# Altium project SCH.PrjPcb
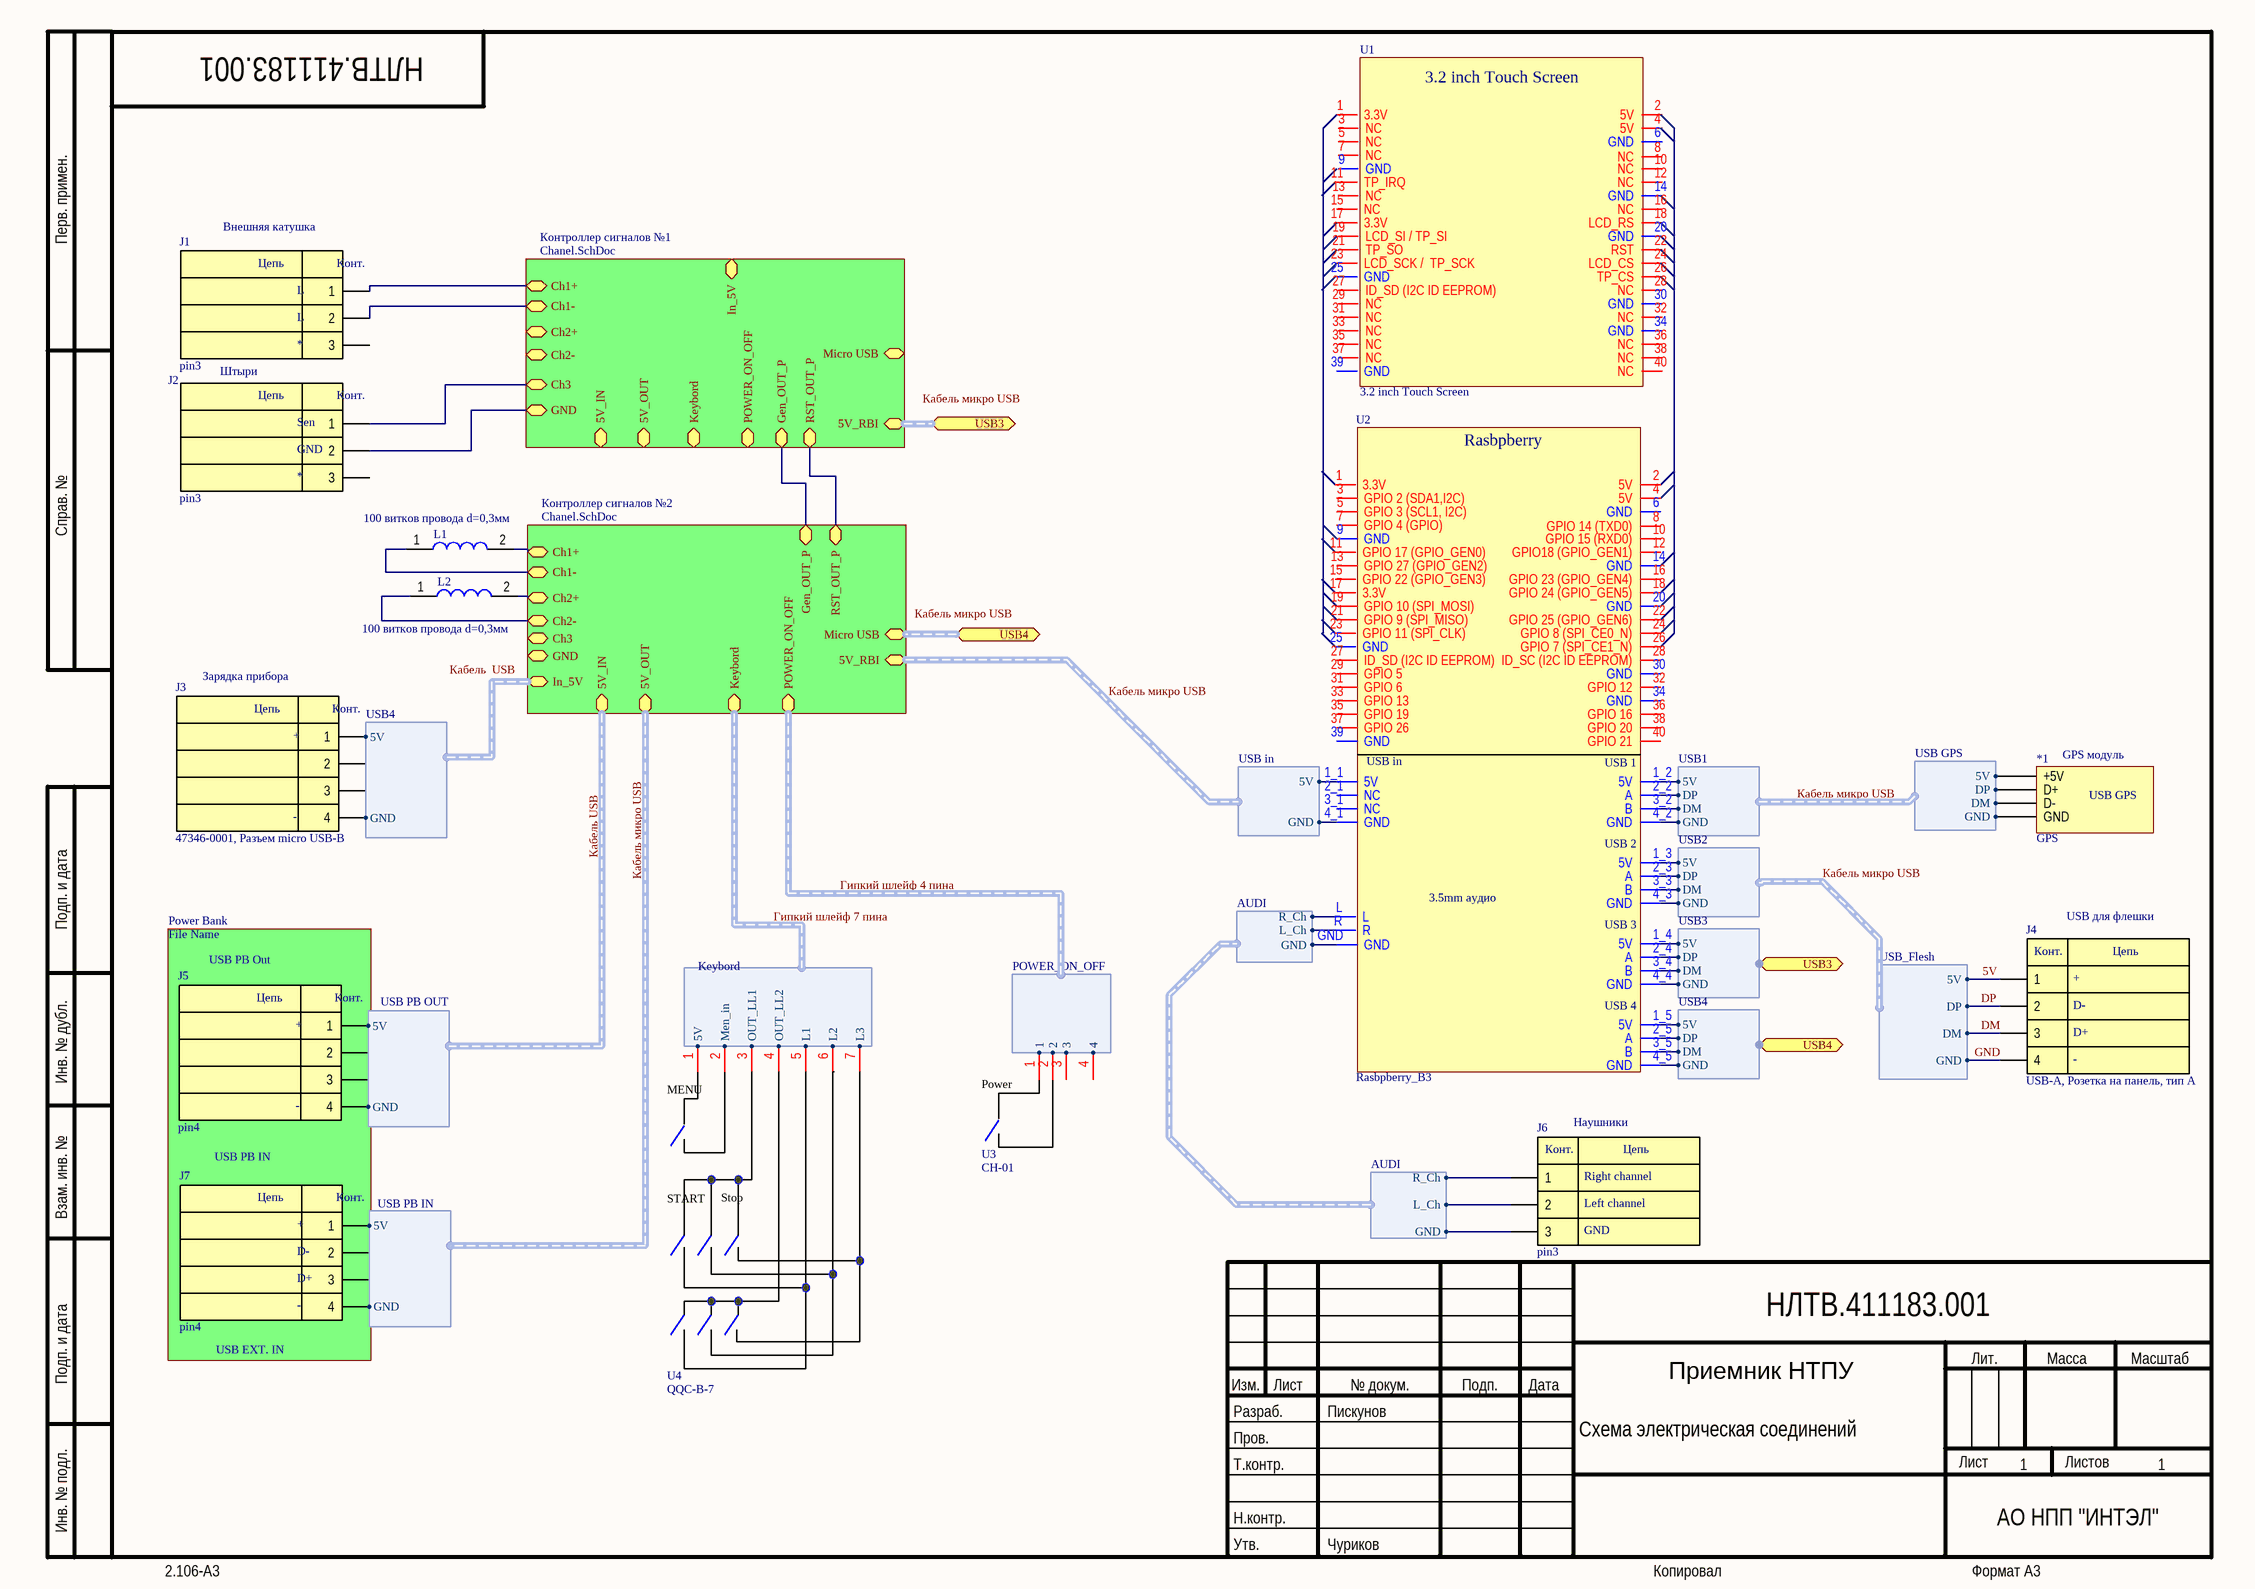
[diagram p0: Main.SchDoc]
2 sheets, 106 parts. Net scope: hierarchical (ports join the sheet entries above them; power ports are global).
Sheets:
  Main.SchDoc
    Контроллер сигналов №1 = Chanel.SchDoc
    Контроллер сигналов №2 = Chanel.SchDoc

## Sheet Main.SchDoc: Приемник НТПУ
size 420 x 297 mm; ApprovedBy: Чуриков; Author: Пискунов; CompanyName: АО НПП "ИНТЭЛ"; DocumentNumber: НЛТВ.411183.001; SheetNumber: 1; SheetTotal: 1; GOST_tip_4erteja: Схема электрическая соединений; CurrentDate: 1

### Parts
*1  GPS
J1  pin3  [300-031-12]
J2  pin3  [300-031-12]
J3  47346-0001, Разъем micro USB-B  [MF-4MA]
J4  USB-A, Розетка на панель, тип А  [MF-4MA]
J5  pin4  [MF-4MA]
J6  pin3  [300-031-12]
J7  pin4  [MF-4MA]
L1  100 витков провода d=0,3мм
L2  100 витков провода d=0,3мм
U1  3.2 inch Touch Screen
U2  Rasbpberry_B3
U3  CH-01  [PSOP8]
U4  QQC-B-7  [PSOP8]

### Sub-sheets
Power Bank = File Name (file not in this document): no entries
Контроллер сигналов №1 = Chanel.SchDoc: Micro USB, Ch1+, Ch1-, Ch2+, Ch2-, Ch3, 5V_IN, 5V_OUT, 5V_RBI (harness 5V_RBI), Gen_OUT_P, RST_OUT_P, Keybord (harness Keybord), POWER_ON_OFF (harness POWER_ON_OFF), In_5V, GND
Контроллер сигналов №2 = Chanel.SchDoc: Micro USB, Ch1+, Ch1-, Ch2+, Ch2-, Ch3, 5V_IN (harness USB PB OUT), 5V_OUT (harness USB PB IN), 5V_RBI (harness USB in), Gen_OUT_P, RST_OUT_P, Keybord (harness Keybord), POWER_ON_OFF (harness POWER_ON_OFF), In_5V (harness USB4), GND

### Ports
USB3, USB3 (harness USB3), USB4, USB4 (harness USB4)

### Harnesses
USB_Flesh: 5V, DP, DM, GND
AUDI: R_Ch, L_Ch, GND
Keybord: 5V, Men_in, OUT_LL1, OUT_LL2, L1, L2, L3
POWER_ON_OFF: 1, 2, 3, 4
USB GPS: 5V, DP, DM, GND
USB1: 5V, DP, DM, GND
USB2: 5V, DP, DM, GND
USB3: 5V, DP, DM, GND
USB4: 5V, DP, DM, GND
USB in: 5V, GND
USB PB OUT: 5V, GND
USB PB IN: 5V, GND
USB4: 5V, GND

### Nets
GND: J2.2 ; sheet Контроллер сигналов №1/GND, sheet Контроллер сигналов №2/GND
5V: *1.?1(+5V) J4.1 J7.1 U2.1_2(5V) U2.1_3(5V) ; sheet Контроллер сигналов №2/5V_OUT.5V
DM: *1.?3(D-) J4.3 U2.3_2(B) U2.3_3(B) ; sheet Контроллер сигналов №2/5V_OUT.DM
DP: *1.?2(D+) J4.2 U2.2_2(A) U2.2_3(A) ; sheet Контроллер сигналов №2/5V_OUT.DP
Gen_OUT_P: sheet Контроллер сигналов №1/Gen_OUT_P, sheet Контроллер сигналов №2/Gen_OUT_P
GND: *1.?4(GND) J4.4 J7.4 U2.4_2(GND) U2.4_3(GND) ; sheet Контроллер сигналов №2/5V_OUT.GND  [a separate net that carries the same name]
RST_OUT_P: sheet Контроллер сигналов №1/RST_OUT_P, sheet Контроллер сигналов №2/RST_OUT_P
Sen: J2.1 ; sheet Контроллер сигналов №1/Ch3
Vout_R1: L1.1 ; sheet Контроллер сигналов №2/Ch1-
Vout_R1: J1.2 ; sheet Контроллер сигналов №1/Ch1-  [a separate net that carries the same name]
Vout_R2: L2.1 ; sheet Контроллер сигналов №2/Ch2-
Гипкий шлейф 4 пина.1: U3.1 ; sheet Контроллер сигналов №2/POWER_ON_OFF.1
Гипкий шлейф 4 пина.2: U3.2 ; sheet Контроллер сигналов №2/POWER_ON_OFF.2
Гипкий шлейф 4 пина.3: U3.3 ; sheet Контроллер сигналов №2/POWER_ON_OFF.3
Гипкий шлейф 4 пина.4: U3.4 ; sheet Контроллер сигналов №2/POWER_ON_OFF.4
Кабель USB.5V: J5.1 ; sheet Контроллер сигналов №2/5V_IN.5V
Кабель USB.GND: J5.4 ; sheet Контроллер сигналов №2/5V_IN.GND
NetJ1_1: J1.1 ; sheet Контроллер сигналов №1/Ch1+
NetJ3_1: J3.1 ; sheet Контроллер сигналов №2/In_5V.5V
NetJ3_4: J3.4 ; sheet Контроллер сигналов №2/In_5V.GND
NetJ6_1: J6.1 U2.L ; harness AUDI.R_Ch
NetJ6_2: J6.2 U2.R ; harness AUDI.L_Ch
NetJ6_3: J6.3 U2.GND ; harness AUDI.GND
NetJ13_Контроллер_сигналов_№2_1: L1.2 ; sheet Контроллер сигналов №2/Ch1+
NetJ14_Контроллер_сигналов_№2_1: L2.2 ; sheet Контроллер сигналов №2/Ch2+
NetU2_1_1: U2.1_1(5V) ; sheet Контроллер сигналов №2/5V_RBI.5V
NetU2_1_4: U2.1_4(5V) ; port USB3.5V
NetU2_1_5: U2.1_5(5V) ; port USB4.5V
NetU2_2_4: U2.2_4(A) ; port USB3.DP
NetU2_2_5: U2.2_5(A) ; port USB4.DP
NetU2_3_4: U2.3_4(B) ; port USB3.DM
NetU2_3_5: U2.3_5(B) ; port USB4.DM
NetU2_4_1: U2.4_1(GND) ; sheet Контроллер сигналов №2/5V_RBI.GND
NetU2_4_4: U2.4_4(GND) ; port USB3.GND
NetU2_4_5: U2.4_5(GND) ; port USB4.GND

Not connected (* = marked no-connect by the designer): J1 3; J2 3; J3 2 3; J5 2 3; J7 2 3; U1 1(3.3V) 2(5V) 3(NC) 4(5V) 5(NC) 6(GND) 7(NC) 8(NC) 9(GND) 10(NC) 11(TP_IRQ) 12(NC) 13(NC) 14(GND) 15(NC) 16(NC) 17(3.3V) 18(LCD_RS) 19(LCD_SI_/_TP_SI) 20(GND) 21(TP_SO) 22(RST) 23(LCD_SCK_/__TP_SCK) 24(LCD_CS) 25(GND) 26(TP_CS) 27(ID_SD_(I2C_ID_EEPROM)) 28(NC) 29(NC) 30(GND) 31(NC) 32(NC) 33(NC) 34(GND) 35(NC) 36(NC) 37(NC) 38(NC) 39(GND) 40(NC); U2 1(3.3V) 2(5V) 2_1(NC) 3(GPIO_2_(SDA1,I2C)) 3_1(NC) 4(5V) 5(GPIO_3_(SCL1,_I2C)) 6(GND) 7(GPIO_4_(GPIO)) 8(GPIO_14_(TXD0)) 9(GND) 10(GPIO_15_(RXD0)) 11(GPIO_17_(GPIO_GEN0)) 12(GPIO18_(GPIO_GEN1)) 13(GPIO_27_(GPIO_GEN2)) 14(GND) 15(GPIO_22_(GPIO_GEN3)) 16(GPIO_23_(GPIO_GEN4)) 17(3.3V) 18(GPIO_24_(GPIO_GEN5)) 19(GPIO_10_(SPI_MOSI)) 20(GND) 21(GPIO_9_(SPI_MISO)) 22(GPIO_25_(GPIO_GEN6)) 23(GPIO_11_(SPI_CLK)) 24(GPIO_8_(SPI_CE0_N)) 25(GND) 26(GPIO_7_(SPI_CE1_N)) 27(ID_SD_(I2C_ID_EEPROM)) 28(ID_SC_(I2C_ID_EEPROM)) 29(GPIO_5) 30(GND) 31(GPIO_6) 32(GPIO_12) 33(GPIO_13) 34(GND) 35(GPIO_19) 36(GPIO_16) 37(GPIO_26) 38(GPIO_20) 39(GND) 40(GPIO_21); U4 1 2 3 4 5 6 7

### Buses and harness runs
harness port USB3 = sheet Контроллер сигналов №1/5V_RBI
harness port USB4 = sheet Контроллер сигналов №2/Micro USB
harness Гипкий шлейф 4 пина = sheet Контроллер сигналов №2/POWER_ON_OFF
harness Гипкий шлейф 7 пина = sheet Контроллер сигналов №2/Keybord
harness Кабель USB = sheet Контроллер сигналов №2/5V_IN
harness Кабель микро USB = sheet Контроллер сигналов №2/5V_OUT

### Notes on the sheet
- Внешняя катушка
- Штыри
- Зарядка прибора
- (near *1) GPS модуль
- USB для флешки
- USB PB Out
- Наушники
- USB PB IN
- USB EXT. IN
- Labels drawn without touching a wire or pin: Кабель  USB, Кабель микро USB
- Перв. примен.
- Справ. №
- Подп. и дата
- Инв. № дубл.
- Взам. инв. №
- Разраб.
- Изм.
- Лист
- № докум.
- Подп.
- Дата
- Лит.
- Масса
- Масштаб
- Пров.
- Т.контр.
- Листов
- Инв. № подл.
- Утв.
- Н.контр.
- 2.106-A3
- Копировал
- Формат А3
- (in symbol CH-01) Power
- (in symbol GPS) USB GPS
- (in symbol pin3) Цепь; Конт.
- (in symbol pin4) Цепь; Конт.
- (in symbol QQC-B-7) MENU; START; Stop
- (in symbol Rasbpberry_B3) Rasbpberry; USB in; USB 1; USB 2; 3.5mm аудио; USB 3; USB 4

### Library data of the parts
J1 = pin3: Name1: L; Name2: L; Name3: *
J2 = pin3: Name1: Sen; Name2: GND; Name3: *
J3 J5 = pin4: Name1: +; Name4: -
J4 J7 = pin4: Name1: +; Name2: D-; Name3: D+; Name4: -
J6 = pin3: Name1: Right channel; Name2: Left channel; Name3: GND
L1 L2 = Inductor_2: Published: 24-Mar-1999; LatestRevisionDate: 17-Jul-2002; LatestRevisionNote: Re-released for DXP Platform.; PackageReference: AXIAL-0.9; Publisher: Altium Limited; PackageDescription: Axial Device, Thru-Hole; 2 Leads; 0.9 in Pin Spacing

## Sheet Chanel.SchDoc: Котроллер сигналов
size 420 x 297 mm; ApprovedBy: Чуриков; Author: Писукнов; CompanyName: АО НПП "ИТЭЛ"; DocumentNumber: НЛТВ.411183.002; SheetNumber: 1; SheetTotal: 1; GOST_tip_4erteja: Схема электрическая принципиальная
Used 2 times, as channels Контроллер сигналов №1, Контроллер сигналов №2. Parts and nets are listed once, with the designators drawn on the sheet.
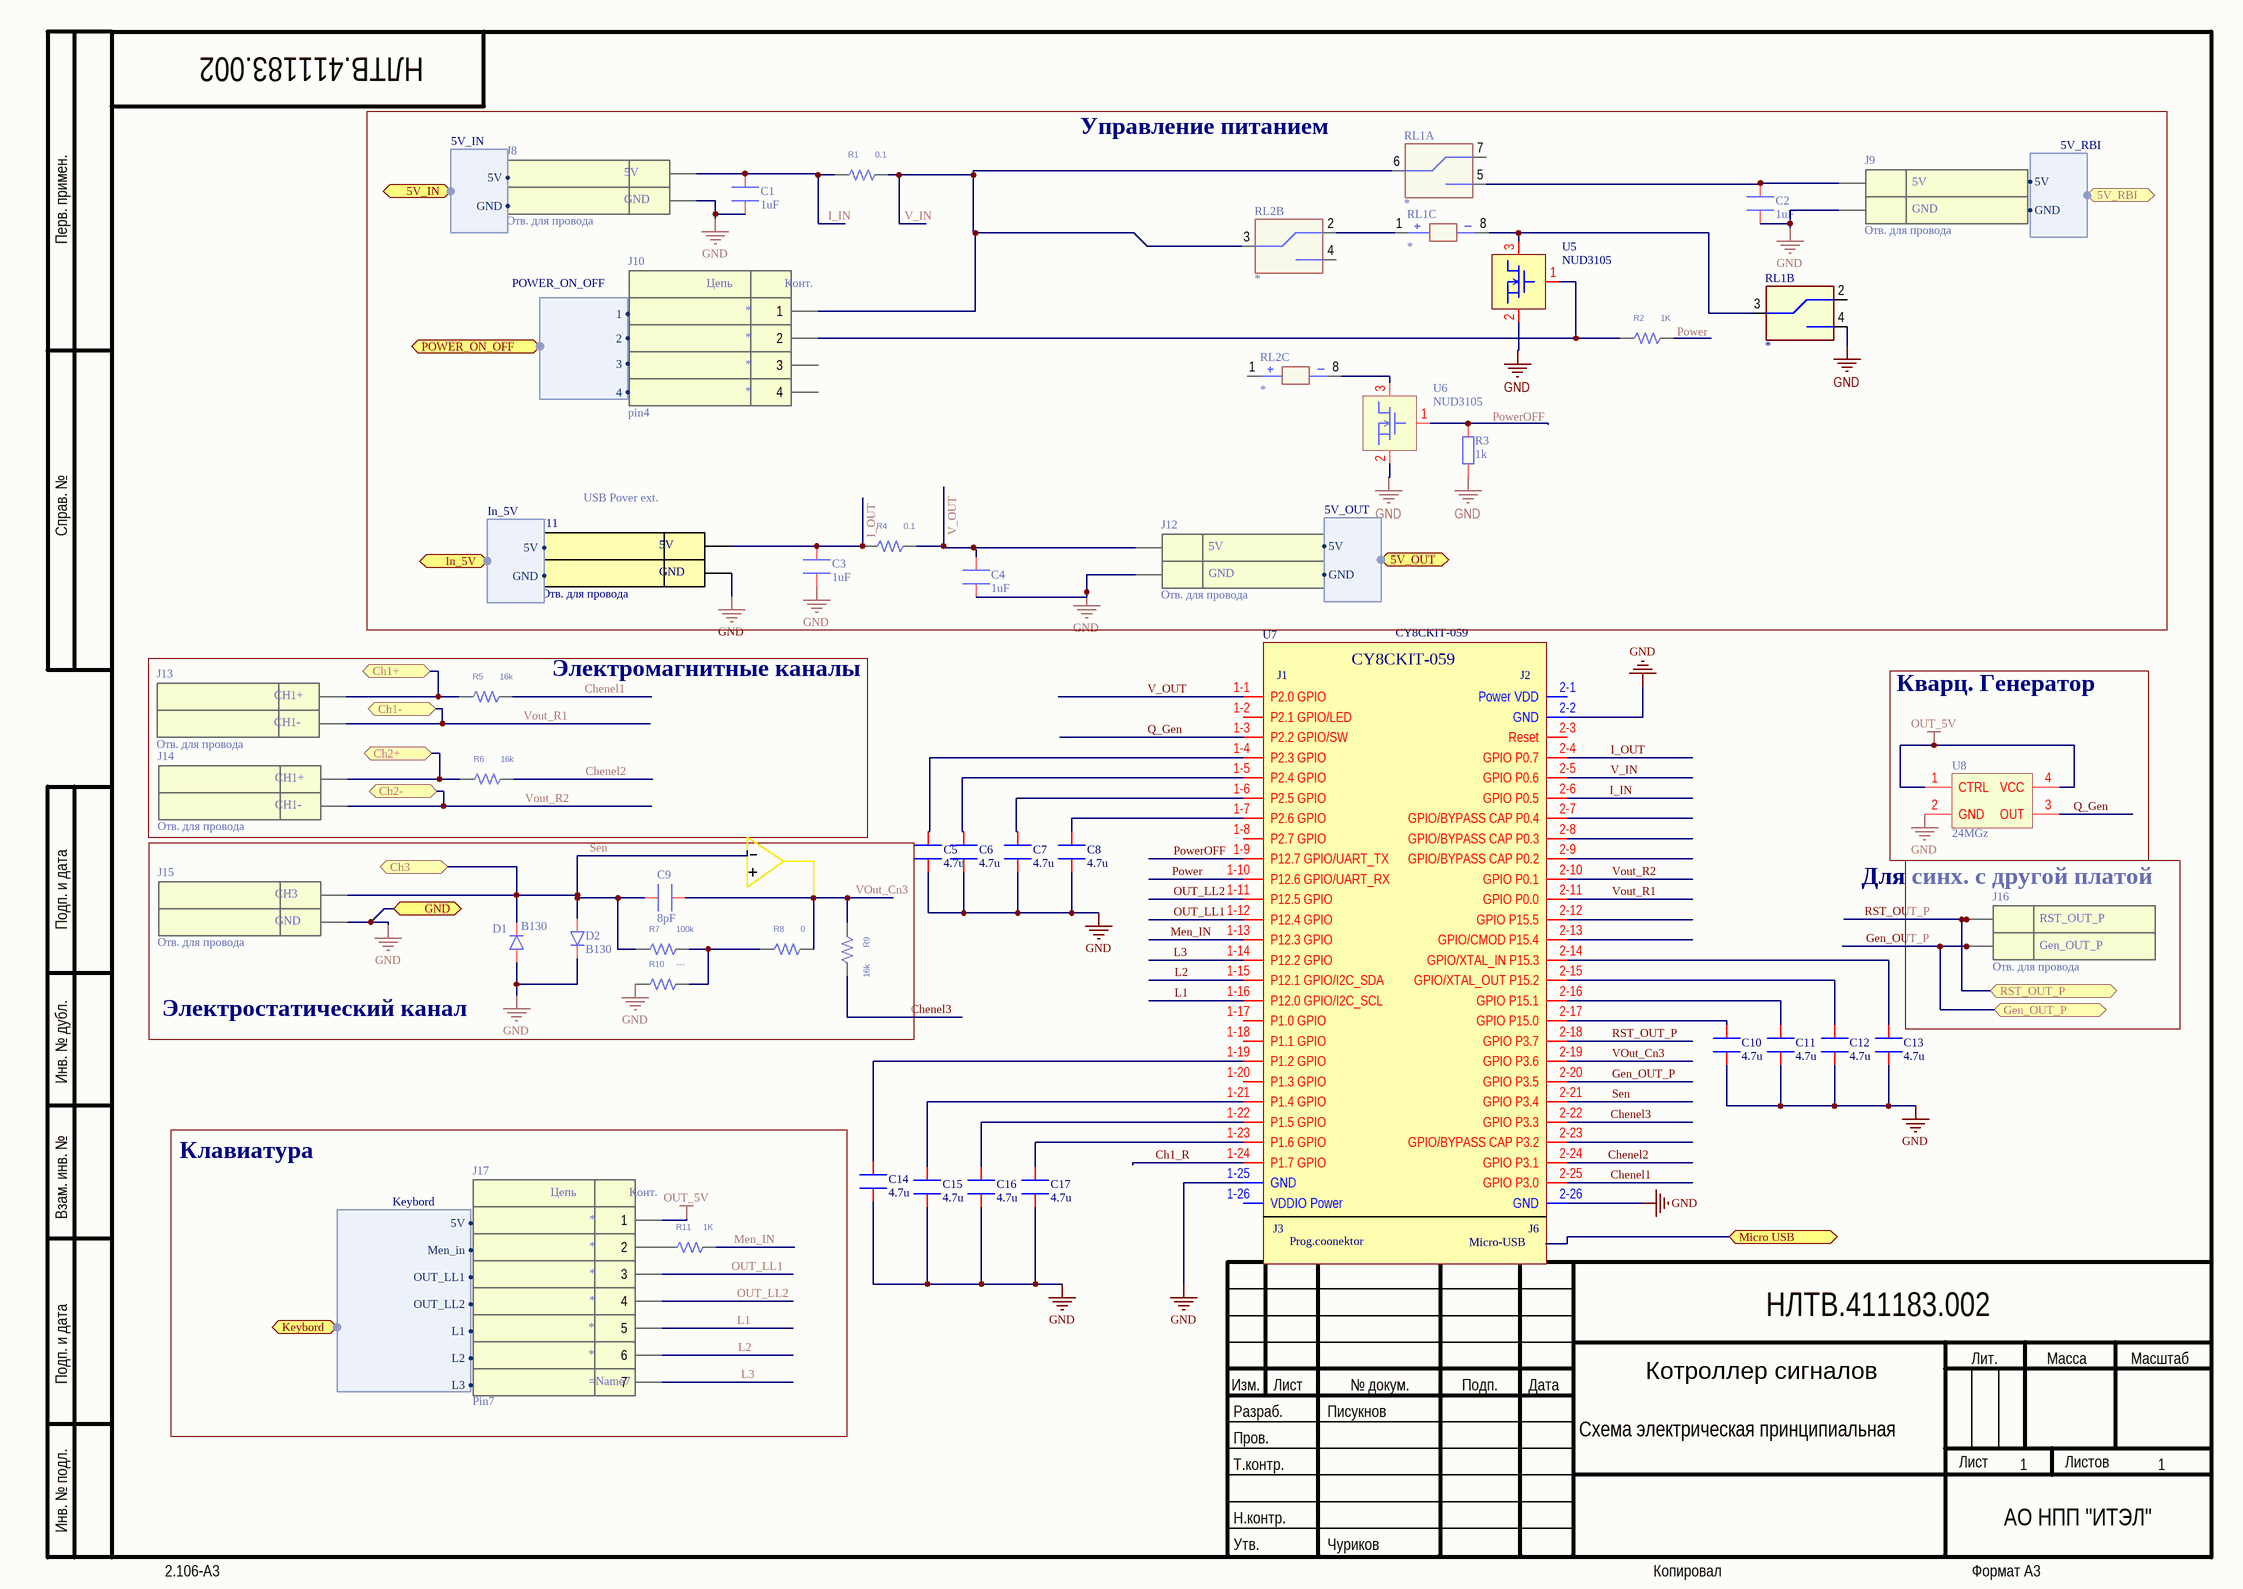
[diagram p1: Chanel.SchDoc]

### Parts
C1  1uF  [SMD0603]
C2  1uF  [SMD0603]
C3  1uF  [SMD0603]
C4  1uF  [SMD0603]
C5  4.7u  [SMD0805]
C6  4.7u  [SMD0805]
C7  4.7u  [SMD0805]
C8  4.7u  [SMD0805]
C9  8pF  [SMD0805]
C10  4.7u  [SMD0805]
C11  4.7u  [SMD0805]
C12  4.7u  [SMD0805]
C13  4.7u  [SMD0805]
C14  4.7u  [SMD0805]
C15  4.7u  [SMD0805]
C16  4.7u  [SMD0805]
C17  4.7u  [SMD0805]
D1  B130  [SMA DIOD]
D2  B130  [SMA DIOD]
J8  Отв. для провода  [JAMPER 2]
J9  Отв. для провода  [JAMPER 2]
J10  pin4  [MF-4MA]
J11  Отв. для провода  [JAMPER 2]
J12  Отв. для провода  [JAMPER 2]
J13  Отв. для провода  [JAMPER 2]
J14  Отв. для провода  [JAMPER 2]
J15  Отв. для провода  [JAMPER 2]
J16  Отв. для провода  [JAMPER 2]
J17  Pin7  [ECH350V-06P]
R1  0.1  [SMD1206]
R2  1K  [SMD1206]
R3  1k  [SMD0805]
R4  0.1  [SMD1206]
R5  16k  [SMD1206]
R6  16k  [SMD1206]
R7  100k  [SMD1206]
R8  0  [SMD1206]
R9  16k  [SMD1206]
R10  ---  [SMD1206]
R11  1K  [SMD1206]
RL1  *  [IM06GR]  (parts A,B,C of 3)
RL2  *  [IM06GR]  (parts B,C of 3)
U5  NUD3105  [SOT-23]
U6  NUD3105  [SOT-23]
U7  CY8CKIT-059  [CY8CKIT-059]
U8  24MGz

### Blocks framed on the sheet
Управление питанием: C1-C4 J8-J12 R1-R4 RL1 RL2 U5 U6
Электромагнитные каналы: J13 J14 R5 R6
Кварц. Генератор: U8
Электростатический канал: C9 D1 D2 J15 R7-R10
Клавиатура: J17 R11

### Ports
5V_IN (harness 5V_IN), 5V_OUT (harness 5V_OUT), 5V_RBI (harness 5V_RBI), Ch1+, Ch1-, Ch2+, Ch2-, Ch3, Gen_OUT_P, GND, In_5V (harness In_5V), Keybord (harness Keybord), Micro USB (bidir), POWER_ON_OFF (harness POWER_ON_OFF), RST_OUT_P

### Harnesses
Keybord: 5V, Men_in, OUT_LL1, OUT_LL2, L1, L2, L3
POWER_ON_OFF: 1, 2, 3, 4
5V_RBI: 5V, GND
5V_IN: 5V, GND
In_5V: 5V, GND
5V_OUT: 5V, GND

### Nets
GND: C1.1 C2.1 C3.1 C4.1 C5.1 C6.1 C7.1 C8.1 C10.1 C11.1 C12.1 C13.1 C14.1 C15.1 C16.1 C17.1 D1.A D2.K J8.2 J9.2 J11.2 J12.2 J15.2 R3.1 R10.1 RL1.4(A14) U5.2(S) U6.2(S) U7.1-25(GND) U7.2-2(GND) U7.2-26(GND) U8.2(GND) ; port GND
OUT_5V: J17.1 U8.1(CTRL) U8.4(VCC)
Ch1+: J13.1 R5.1 ; port Ch1+
Ch1_R: U7.1-24(P1.7_GPIO)
Ch2+: J14.1 R6.1 ; port Ch2+
Chenel1: R5.2 U7.2-25(GPIO_P3.0)
Chenel2: R6.2 U7.2-24(GPIO_P3.1)
Chenel3: R9.2 U7.2-22(GPIO_P3.3)
Gen_OUT_P: J16.2 U7.2-20(GPIO_P3.5) ; port Gen_OUT_P
I_IN: C1.2 J8.1 R1.1 U7.2-6(GPIO_P0.5)
I_OUT: C3.2 J11.1 R4.1 U7.2-4(GPIO_P0.7)
L1: J17.5 U7.1-16(P12.0_GPIO/I2C_SCL)
L2: J17.6 U7.1-15(P12.1_GPIO/I2C_SDA)
L3: J17.7 U7.1-14(P12.2_GPIO)
Men_IN: R11.2 U7.1-13(P12.3_GPIO)
OUT_LL1: J17.3 U7.1-12(P12.4_GPIO)
OUT_LL2: J17.4 U7.1-11(P12.5_GPIO)
Power: U7.1-10(P12.6_GPIO/UART_RX)
PowerOFF: U7.1-9(P12.7_GPIO/UART_TX)
Q_Gen: U7.1-3(P2.2_GPIO/SW) U8.3(OUT)
RST_OUT_P: J16.1 U7.2-18(GPIO_P3.7) ; port RST_OUT_P
Sen: C9.2 D1.K D2.A J15.1 R7.1 U7.2-21(GPIO_P3.4) ; port Ch3
V_IN: J10.1 R1.2 RL1.6(A9) RL2.3(A12) U7.2-5(GPIO_P0.6)
V_OUT: C4.2 J12.1 R4.2 U7.1-1(P2.0_GPIO)
VOut_Cn3: C9.1 R8.2 R9.1 U7.2-19(GPIO_P3.6)
Vout_R1: J13.2 U7.2-11(GPIO_P0.0) ; port Ch1-
Vout_R2: J14.2 U7.2-10(GPIO_P0.1) ; port Ch2-
NetC2_2: C2.2 J9.1 RL1.5(A11)
NetC5_2: C5.2 U7.1-4(P2.3_GPIO)
NetC6_2: C6.2 U7.1-5(P2.4_GPIO)
NetC7_2: C7.2 U7.1-6(P2.5_GPIO)
NetC8_2: C8.2 U7.1-7(P2.6_GPIO)
NetC10_2: C10.2 U7.2-17(GPIO_P15.0)
NetC11_2: C11.2 U7.2-16(GPIO_P15.1)
NetC12_2: C12.2 U7.2-15(GPIO/XTAL_OUT_P15.2)
NetC13_2: C13.2 U7.2-14(GPIO/XTAL_IN_P15.3)
NetC14_2: C14.2 U7.1-19(P1.2_GPIO)
NetC15_2: C15.2 U7.1-21(P1.4_GPIO)
NetC16_2: C16.2 U7.1-22(P1.5_GPIO)
NetC17_2: C17.2 U7.1-23(P1.6_GPIO)
NetJ10_2: J10.2 R2.1 U5.1(G)
NetJ17_2: J17.2 R11.1
NetR3_2: R3.2 U6.1(G)
NetR7_2: R7.2 R8.1 R10.2
NetRL1_1: RL1.1(+) RL2.2(A13)
NetRL1_3: RL1.3(A12) RL1.8(-) U5.3(D)
NetRL2_8: RL2.8(-) U6.3(D)

Not connected (* = marked no-connect by the designer): J10 3 4; R2 2; RL1 2(A13) 7(A10); RL2 1(+) 4(A14); U7 1-2(P2.1_GPIO/LED) 1-8(P2.7_GPIO) 1-17(P1.0_GPIO) 1-18(P1.1_GPIO) 1-20(P1.3_GPIO) 1-26(VDDIO_Power) 2-1(Power_VDD) 2-3(Reset) 2-7(GPIO/BYPASS_CAP_P0.4) 2-8(GPIO/BYPASS_CAP_P0.3) 2-9(GPIO/BYPASS_CAP_P0.2) 2-12(GPIO_P15.5) 2-13(GPIO/CMOD_P15.4) 2-23(GPIO/BYPASS_CAP_P3.2)

### Channels
Контроллер сигналов №1: designators end in _Контроллер_сигналов_№1; ports Ch1+=NetJ1_1 Ch1-=Vout_R1 Ch2+=NetJ14_Контроллер_сигналов_№1_1 Ch2-=Vout_R2_Контроллер сигналов №1 Ch3=Sen Gen_OUT_P=Gen_OUT_P GND=GND Micro USB=open RST_OUT_P=RST_OUT_P
Контроллер сигналов №2: designators end in _Контроллер_сигналов_№2; ports Ch1+=NetJ13_Контроллер_сигналов_№2_1 Ch1-=Vout_R1 Ch2+=NetJ14_Контроллер_сигналов_№2_1 Ch2-=Vout_R2 Ch3=Sen_Контроллер сигналов №2 Gen_OUT_P=Gen_OUT_P GND=GND Micro USB=open RST_OUT_P=RST_OUT_P

### Notes on the sheet
- USB Pover ext.
- (near J16) Для синх. с другой платой
- Labels drawn without touching a wire or pin: Power, PowerOFF
- Перв. примен.
- Справ. №
- Подп. и дата
- Инв. № дубл.
- Взам. инв. №
- Разраб.
- Изм.
- Лист
- № докум.
- Подп.
- Дата
- Лит.
- Масса
- Масштаб
- Пров.
- Т.контр.
- Листов
- Инв. № подл.
- Утв.
- Н.контр.
- 2.106-A3
- Копировал
- Формат А3
- (in symbol CY8CKIT-059) J1; J2; J3; J6; Prog.coonektor; Micro-USB
- (in symbol pin4) Цепь; Конт.
- (in symbol Pin7) Цепь; Конт.

### Library data of the parts
C1-C8 C10-C17 = CAP
  C1-C4: value: *
  C5-C8 C10-C17: value: 4.7u
C9 = CAP: value: 4.7u
D1 D2 = DIOD: value: *
J8 J9 J11 J12 = pin2_continuation: Name1: 5V; Name2: GND
J13 J14 = pin2_continuation: Name1: CH1+; Name2: CH1-
J15 = pin2_continuation: Name1: CH3; Name2: GND
J16 = pin2_continuation: Name1: RST_OUT_P; Name2: Gen_OUT_P
R1 R2 R4 R7 R10 R11 = R: TC2: 0; POWER: RMAX; MAX_TEMP: RTMAX; SLOPE: RSMAX; VOLTAGE: RVMAX; PSpiceTemplate: R^@REFDES %1 %2 ?TOLERANCE|R^@REFDES| @VALUE TC=@TC1,@TC2 ?TOLERANCE|\n.model R^@REFDES RES R=1 DEV=@TOLERANCE% TC1=@TC1 TC2=@TC2|; DIST: FLAT; Value: 16k; TC1: 0
R3 = RES_SMD: value: 1k
R5 R6 R9 = R: TC2: 0; POWER: RMAX; MAX_TEMP: RTMAX; SLOPE: RSMAX; VOLTAGE: RVMAX; PSpiceTemplate: R^@REFDES %1 %2 ?TOLERANCE|R^@REFDES| @VALUE TC=@TC1,@TC2 ?TOLERANCE|\n.model R^@REFDES RES R=1 DEV=@TOLERANCE% TC1=@TC1 TC2=@TC2|; DIST: FLAT; TC1: 0; Value: 16k
R8 = R: POWER: RMAX; MAX_TEMP: RTMAX; SLOPE: RSMAX; VOLTAGE: RVMAX; PSpiceTemplate: R^@REFDES %1 %2 ?TOLERANCE|R^@REFDES| @VALUE TC=@TC1,@TC2 ?TOLERANCE|\n.model R^@REFDES RES R=1 DEV=@TOLERANCE% TC1=@TC1 TC2=@TC2|; DIST: FLAT; Value: 16k; TC2: 0; TC1: 0
RL1 RL2 = Relay_2 switch: value: *
U8 = KXO-97
J10 = pin4: Name1: *; Name2: *; Name3: *; Name4: *
J17 = Pin7: Name1: *; Name2: *; Name3: *; Name4: *; Name5: *; Name6: *

## Nets that join several sheets
GND: Main (J2.2), Контроллер сигналов №1 (32 pins), Контроллер сигналов №2 (32 pins)
OUT_5V: Контроллер сигналов №1 (J17_Контроллер_сигналов_№1.1 U8_Контроллер_сигналов_№1.1 U8_Контроллер_сигналов_№1.4), Контроллер сигналов №2 (J17_Контроллер_сигналов_№2.1 U8_Контроллер_сигналов_№2.1 U8_Контроллер_сигналов_№2.4)
Gen_OUT_P: Контроллер сигналов №1 (J16_Контроллер_сигналов_№1.2 U7_Контроллер_сигналов_№1.2-20), Контроллер сигналов №2 (J16_Контроллер_сигналов_№2.2 U7_Контроллер_сигналов_№2.2-20)
NetJ1_1: Main (J1.1), Контроллер сигналов №1 (J13_Контроллер_сигналов_№1.1 R5_Контроллер_сигналов_№1.1)
NetJ13_Контроллер_сигналов_№2_1: Main (L1.2), Контроллер сигналов №2 (J13_Контроллер_сигналов_№2.1 R5_Контроллер_сигналов_№2.1)
NetJ14_Контроллер_сигналов_№2_1: Main (L2.2), Контроллер сигналов №2 (J14_Контроллер_сигналов_№2.1 R6_Контроллер_сигналов_№2.1)
RST_OUT_P: Контроллер сигналов №1 (J16_Контроллер_сигналов_№1.1 U7_Контроллер_сигналов_№1.2-18), Контроллер сигналов №2 (J16_Контроллер_сигналов_№2.1 U7_Контроллер_сигналов_№2.2-18)
Sen: Main (J2.1), Контроллер сигналов №1 (6 pins)
Vout_R1: Main (L1.1), Контроллер сигналов №2 (J13_Контроллер_сигналов_№2.2 U7_Контроллер_сигналов_№2.2-11)
Vout_R1: Main (J1.2), Контроллер сигналов №1 (J13_Контроллер_сигналов_№1.2 U7_Контроллер_сигналов_№1.2-11)
Vout_R2: Main (L2.1), Контроллер сигналов №2 (J14_Контроллер_сигналов_№2.2 U7_Контроллер_сигналов_№2.2-10)